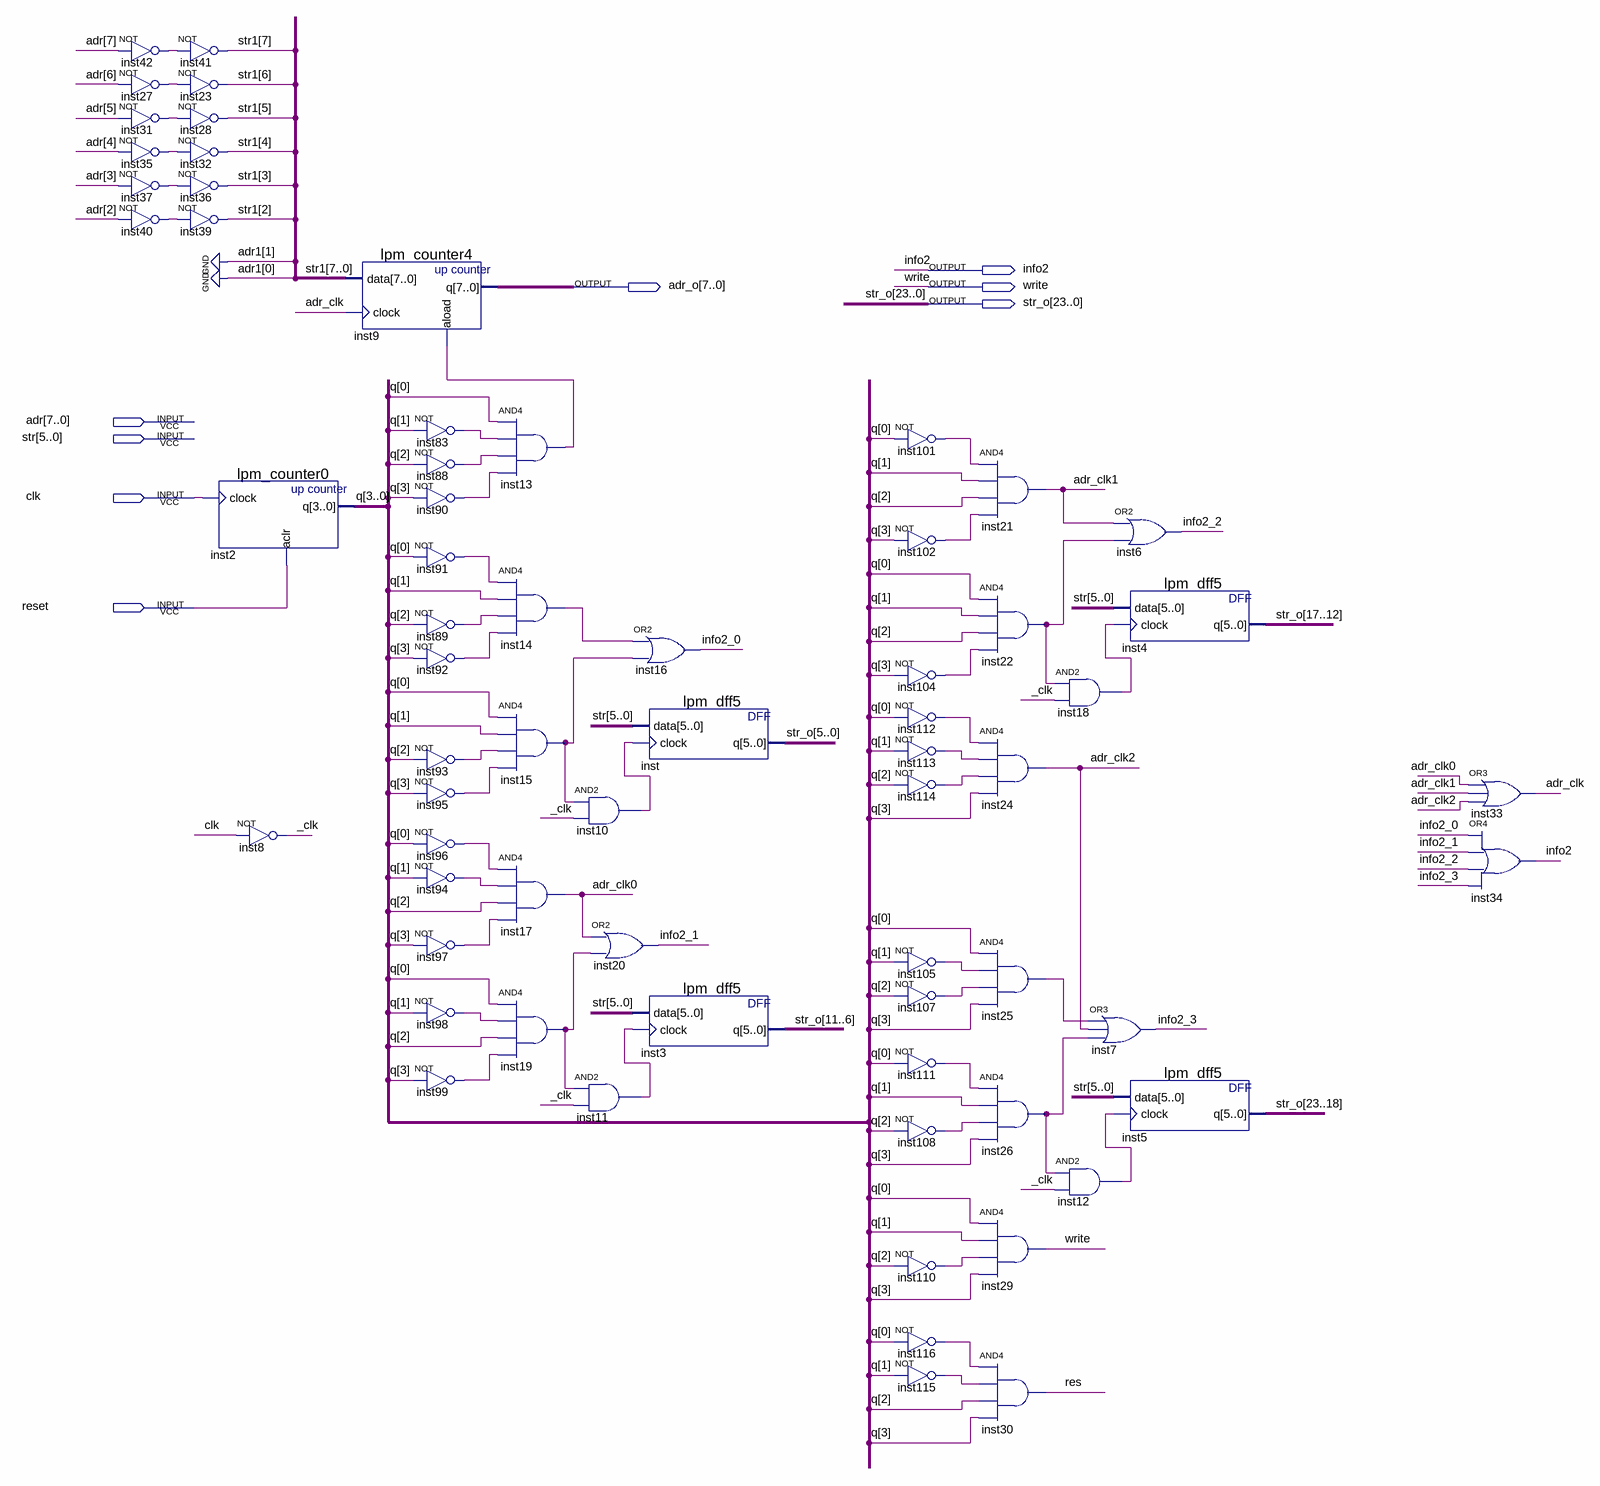
[diagram p0: schematic sheet]
// Quartus schematic read_from_ram.bdf as structural Verilog: 67 symbols, 8 pins
module read_from_ram (
  input  [7:0] adr,
  input  [5:0] str,
  input  clk,
  input  reset,
  output info2,
  output [7:0] adr_o,
  output write,
  output [23:0] str_o
);

  wire _clk, adr_clk, adr_clk0, adr_clk1, adr_clk2, info2_0, info2_1, info2_2, info2_3, inst10_out,
       inst11_out, inst12_out, inst13_out, inst14_out, inst15_out, inst18_out, inst19_out, inst22_out,
       inst25_out, inst26_out, inst27_out, inst31_out, inst35_out, inst37_out, inst40_out, inst42_out,
       inst83_out, inst88_out, inst89_out, inst90_out, inst91_out, inst92_out, inst93_out, inst94_out,
       inst95_out, inst96_out, inst97_out, inst98_out, inst99_out, inst101_out, inst102_out, inst104_out,
       inst105_out, inst107_out, inst108_out, inst110_out, inst111_out, inst112_out, inst113_out,
       inst114_out, inst115_out, inst116_out, res;
  wire [3:0] q;
  wire [7:0] str1;

  not inst42 (inst42_out, adr[7]);
  not inst27 (inst27_out, adr[6]);
  not inst31 (inst31_out, adr[5]);
  not inst35 (inst35_out, adr[4]);
  not inst37 (inst37_out, adr[3]);
  not inst40 (inst40_out, adr[2]);
  not inst41 (str1[7], inst42_out);
  not inst23 (str1[6], inst27_out);
  not inst28 (str1[5], inst31_out);
  not inst32 (str1[4], inst35_out);
  not inst36 (str1[3], inst37_out);
  not inst39 (str1[2], inst40_out);
  lpm_counter0 inst2 (.clock(clk), .aclr(reset), .q(q));
  not inst8 (_clk, clk);
  lpm_counter4 inst9 (.data(str1), .clock(adr_clk), .aload(inst13_out), .q(adr_o));
  not inst83 (inst83_out, q[1]);
  not inst88 (inst88_out, q[2]);
  not inst90 (inst90_out, q[3]);
  not inst91 (inst91_out, q[0]);
  not inst89 (inst89_out, q[2]);
  not inst92 (inst92_out, q[3]);
  not inst93 (inst93_out, q[2]);
  not inst95 (inst95_out, q[3]);
  not inst96 (inst96_out, q[0]);
  not inst94 (inst94_out, q[1]);
  not inst97 (inst97_out, q[3]);
  not inst98 (inst98_out, q[1]);
  not inst99 (inst99_out, q[3]);
  and inst13 (inst13_out, q[0], inst83_out, inst88_out, inst90_out);
  and inst14 (inst14_out, inst91_out, q[1], inst89_out, inst92_out);
  and inst15 (inst15_out, q[0], q[1], inst93_out, inst95_out);
  and inst17 (adr_clk0, inst96_out, inst94_out, q[2], inst97_out);
  and inst19 (inst19_out, q[0], inst98_out, q[2], inst99_out);
  and inst10 (inst10_out, inst15_out, _clk);
  or inst20 (info2_1, adr_clk0, inst19_out);
  and inst11 (inst11_out, inst19_out, _clk);
  or inst16 (info2_0, inst14_out, inst15_out);
  lpm_dff5 inst (.data(str), .clock(inst10_out), .q(str_o[5:0]));
  lpm_dff5 inst3 (.data(str), .clock(inst11_out), .q(str_o[11:6]));
  not inst101 (inst101_out, q[0]);
  not inst102 (inst102_out, q[3]);
  not inst104 (inst104_out, q[3]);
  not inst112 (inst112_out, q[0]);
  not inst113 (inst113_out, q[1]);
  not inst114 (inst114_out, q[2]);
  not inst105 (inst105_out, q[1]);
  not inst107 (inst107_out, q[2]);
  not inst111 (inst111_out, q[0]);
  not inst108 (inst108_out, q[2]);
  not inst110 (inst110_out, q[2]);
  not inst116 (inst116_out, q[0]);
  not inst115 (inst115_out, q[1]);
  and inst21 (adr_clk1, inst101_out, q[1], q[2], inst102_out);
  and inst22 (inst22_out, q[0], q[1], q[2], inst104_out);
  and inst24 (adr_clk2, inst112_out, inst113_out, inst114_out, q[3]);
  and inst25 (inst25_out, q[0], inst105_out, inst107_out, q[3]);
  and inst26 (inst26_out, inst111_out, q[1], inst108_out, q[3]);
  and inst29 (write, q[0], q[1], inst110_out, q[3]);
  and inst30 (res, inst116_out, inst115_out, q[2], q[3]);
  and inst18 (inst18_out, inst22_out, _clk);
  and inst12 (inst12_out, inst26_out, _clk);
  or inst6 (info2_2, adr_clk1, inst22_out);
  lpm_dff5 inst4 (.data(str), .clock(inst18_out), .q(str_o[17:12]));
  or inst7 (info2_3, inst25_out, adr_clk2, inst26_out);
  lpm_dff5 inst5 (.data(str), .clock(inst12_out), .q(str_o[23:18]));
  or inst33 (adr_clk, adr_clk0, adr_clk1, adr_clk2);
  or inst34 (info2, info2_0, info2_1, info2_2, info2_3);
endmodule
